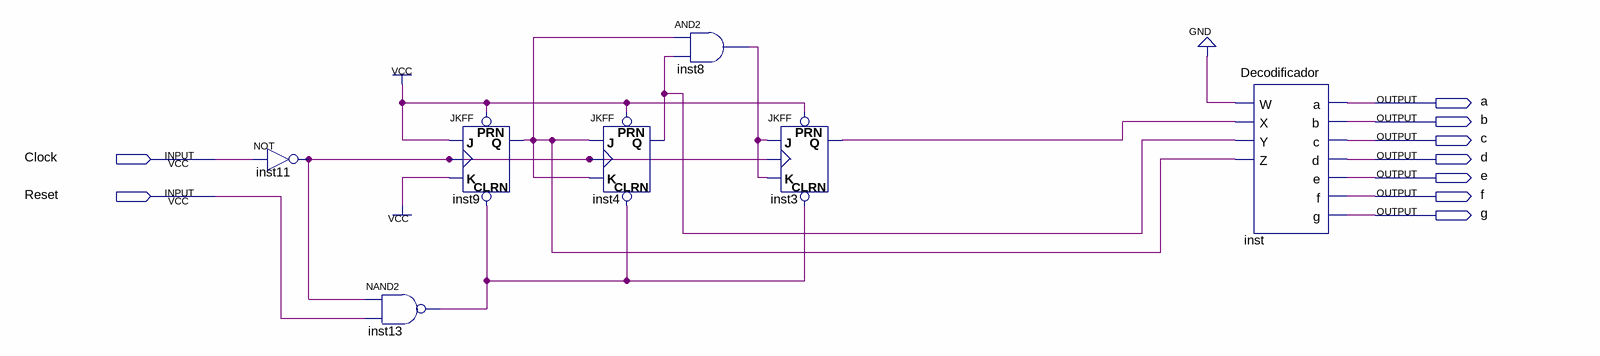
[diagram p0: schematic sheet]
// Quartus schematic ContadorSincrono.bdf as structural Verilog: 7 symbols, 9 pins
module ContadorSincrono (
  input  Clock,
  input  Reset,
  output a,
  output b,
  output c,
  output d,
  output e,
  output f,
  output g
);

  wire inst3_q, inst4_q, inst8_out, inst9_q, inst11_out, inst13_out;

  not inst11 (inst11_out, Clock);
  nand inst13 (inst13_out, inst11_out, Reset);
  JKFF inst9 (.PRN(1'b1), .CLRN(inst13_out), .K(1'b1), .J(1'b1), .CLK(inst11_out), .Q(inst9_q));
  JKFF inst4 (.PRN(1'b1), .CLRN(inst13_out), .K(inst9_q), .J(inst9_q), .CLK(inst11_out), .Q(inst4_q));
  and inst8 (inst8_out, inst9_q, inst4_q);
  JKFF inst3 (.PRN(1'b1), .CLRN(inst13_out), .K(inst8_out), .J(inst8_out), .CLK(inst11_out), .Q(inst3_q));
  Decodificador inst (.W(1'b0), .X(inst3_q), .Y(inst4_q), .Z(inst9_q), .a(a), .b(b), .c(c), .d(d), .e(e), .f(f), .g(g));
endmodule
